# EAGLE design X8R_analog_sensor (EAGLE 6.4)
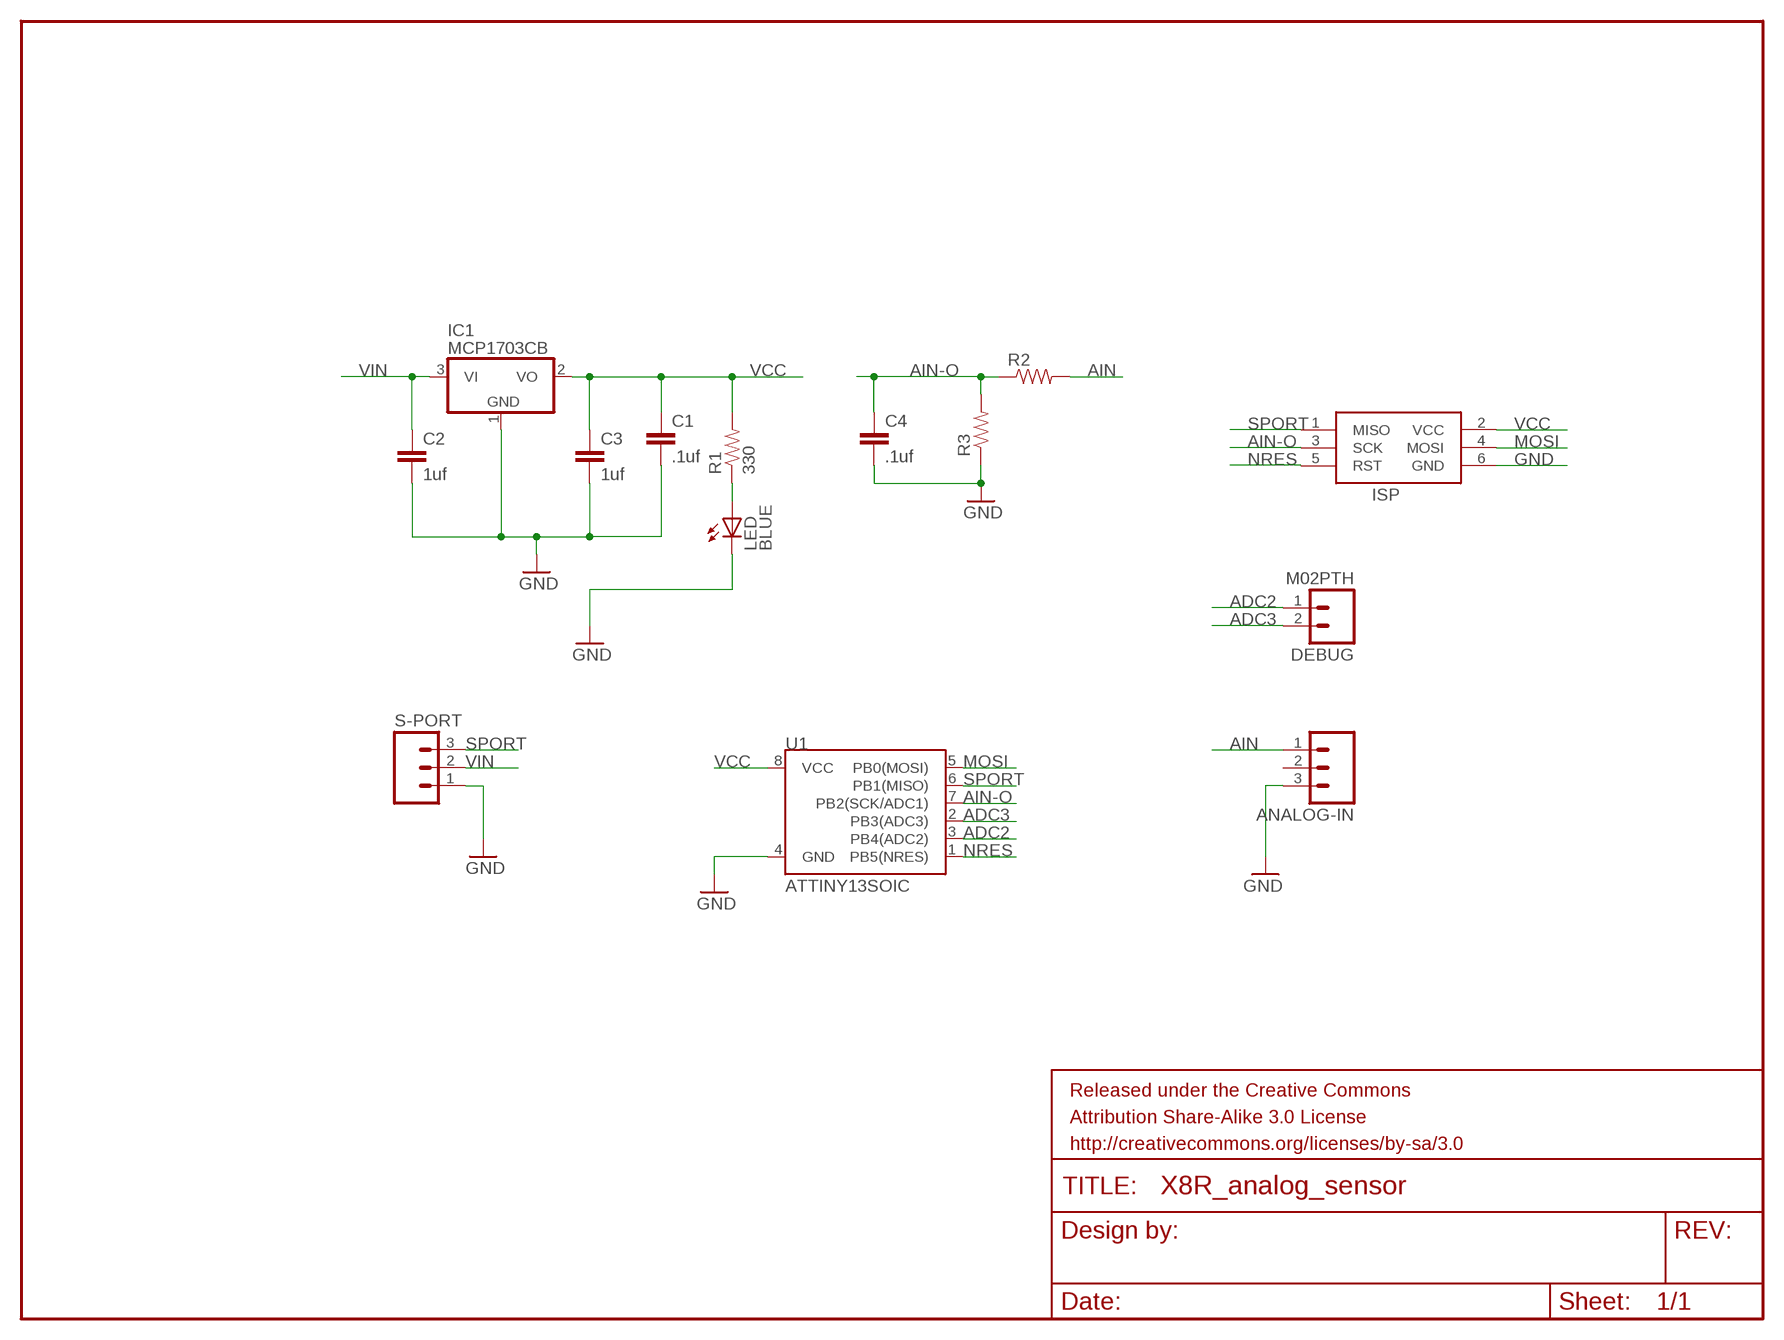
[diagram p0: schematic, sheet 1]

## Parts
ANALOG-IN  M03PTH  [1X03]
C1  .1uf  CAP0603-CAP  [0603-CAP]
C2  1uf  CAP0603-CAP  [0603-CAP]
C3  1uf  CAP0603-CAP  [0603-CAP]
C4  .1uf  CAP0603-CAP  [0603-CAP]
DEBUG  M02PTH  [1X02]
FRAME1  FRAME-LETTER  [CREATIVE_COMMONS]
IC1  MCP1703CB  [SOT23]
ISP  AVRISP-6  [AVRISP]
LED  BLUE  LED0603  [LED-0603]
R1  330  RESISTOR0603  [0603-RES]
R2  RESISTORPTH-1/6W  [1/6W-RES]
R3  RESISTORPTH-1/6W  [1/6W-RES]
S-PORT  M03PTH  [1X03]
U1  ATTINY13SOIC  [SO08]

## Nets
ADC2: DEBUG.1 U1.3(PB4(ADC2))
ADC3: DEBUG.2 U1.2(PB3(ADC3))
AIN: ANALOG-IN.1 R2.2
AIN-O: C4.1 ISP.3(SCK) R2.1 R3.2 U1.7(PB2(SCK/ADC1))
GND: ANALOG-IN.3 C1.2 C2.2 C3.2 C4.2 IC1.1(GND) ISP.6(GND) LED.C R3.1 S-PORT.1 U1.4(GND)
MOSI: ISP.4(MOSI) U1.5(PB0(MOSI))
N$7: LED.A R1.1
NRES: ISP.5(RST) U1.1(PB5(NRES))
SPORT: ISP.1(MISO) S-PORT.3 U1.6(PB1(MISO))
VCC: C1.1 C3.1 IC1.2(VO) ISP.2(VCC) R1.2 U1.8(VCC)
VIN: C2.1 IC1.3(VI) S-PORT.2
Unconnected: ANALOG-IN.2

## Library data of the parts
ANALOG-IN S-PORT = SparkFun-Connectors:M03: Header 3 Standard 3-pin 0.1" header. Use with straight break away headers (SKU : PRT-00116), right angle break away headers (PRT-00553), swiss pins (PRT-00743), machine pins (PRT-00117), and female headers (PRT-00115). Molex polarized connector foot print use with SKU : PRT-08232 with associated crimp pins and housings.
C1-C4 = SparkFun-Capacitors:CAP: Capacitor Standard 0603 ceramic capacitor, and 0.1" leaded capacitor.
DEBUG = SparkFun-Connectors:M02: Standard 2-pin 0.1" header. Use with - straight break away headers ( PRT-00116) - right angle break away headers (PRT-00553) - swiss pins (PRT-00743) - machine pins (PRT-00117) - female headers (PRT-00115) Molex polarized connector foot print use with: PRT-08233 with associated crimp pins and housings. 2.54_SCREWTERM for use with PRT-10571. 3.5mm Screw Terminal footprints for PRT-08084 5mm Screw Terminal footprints for use with PRT-08433
FRAME1 = SparkFun-Aesthetics:FRAME-LETTER: Schematic Frame Standard 8.5x11 US Letter frame
IC1 = linear:MCP1703: 250 mA, 16V, Low Quiescent Current LDO Regulator Source: http://ww1.microchip.com/downloads/en/DeviceDoc/22049b.pdf
ISP = adafruit:AVRISP: AVR ISP HEADER Standard 6 pin header for AVR programming
LED = SparkFun-LED:LED: LEDs Standard schematic elements and footprints for 5mm, 3mm, 1206, and 0603 sized LEDs. 5mm - Spark Fun Electronics SKU : COM-00529 (and others)
R1 = SparkFun-Resistors:RESISTOR: Resistor Basic schematic elements and footprints for 0603, 1206, and PTH resistors.
R2 R3 = SparkFun-Passives:RESISTOR: Resistor Basic schematic elements and footprints for 0603, 1206, and PTH resistors.
U1 = SparkFun-DigitalIC:ATTINY13: Atmel 8-pin 1kB flash uC

## Board
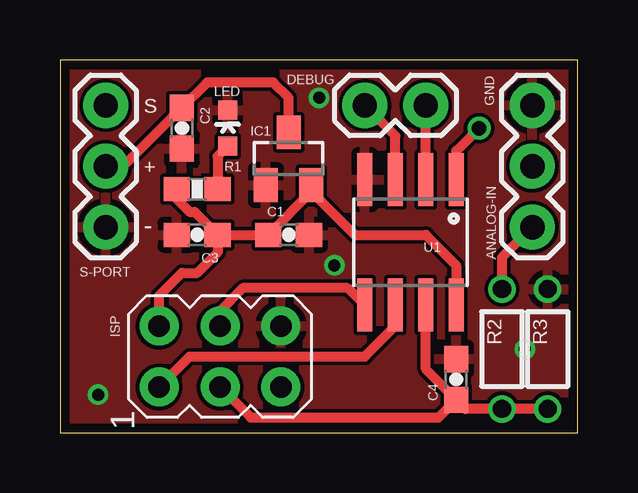
[diagram p1: board, top side]
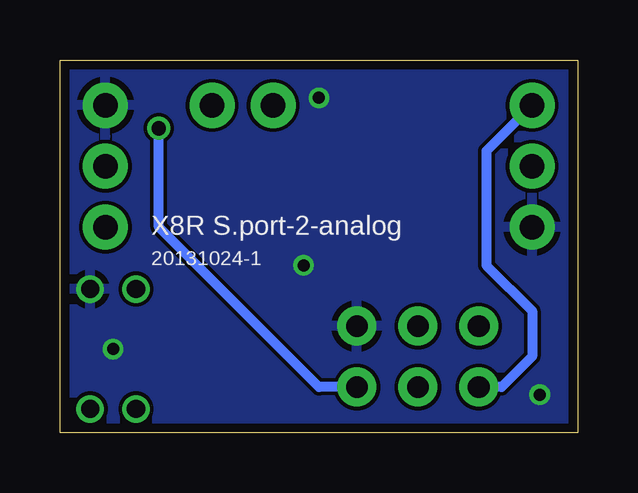
[diagram p2: board, bottom side, seen from below]

Size 21.58 x 15.55 mm. Coordinates in mm from the lower left corner, seen from the top.
Outline: 0,0 21.58,0 21.58,15.55 0,15.55 0,0
Copper layers (1*16): Top 0.0356mm / dielectric 1.5011mm / Bottom 0.0356mm
Design rules "LaenPCBOrder *": minimum track width 6mil, minimum drill 13mil, track to track 6mil, track to pad 6mil, pad to pad 6mil, via to via 6mil, smd to smd 6mil, copper to edge 15mil, drill to drill 6mil, minimum pad ring 7mil, minimum via ring 7mil, stop-mask expansion 3mil, vias tented up to drill 25mil, thermal gap 10mil

### Footprints (pad centres in the part's own frame; a part is rotated, then mirrored left to right if it is on the bottom)
1X03 = drill 1.016 pad 1.88: 1 0,0; 2 2.54,0; 3 5.08,0
0603-CAP = smd 1.1 x 1: 1 -0.85,0; 2 0.85,0
1X02 = drill 1.016 pad 1.88: 1 0,0; 2 2.54,0
SOT23 = smd 1 x 1.4: 1 -0.95,-1.1; 2 0.95,-1.1; 3 0,1.1
AVRISP = drill 0.9 pad 1.626: 1 -1.27,2.54; 2 1.27,2.54; 3 -1.27,0; 4 1.27,0; 5 -1.27,-2.54; 6 1.27,-2.54
LED-0603 = smd 0.8 x 0.8: A 0,-0.75; C 0,0.75
0603-RES = smd 1.1 x 1: 1 -0.85,0; 2 0.85,0
1/6W-RES = drill 0.762: 1 -2.5,0; 2 2.5,0
SO08 = smd 0.61 x 2.21: 1 -1.905,-2.616; 2 -0.635,-2.616; 3 0.635,-2.616; 4 1.905,-2.616; 5 1.905,2.616; 6 0.635,2.616; 7 -0.635,2.616; 8 -1.905,2.616

### Placement (x,y rotation side)
ANALOG-IN  19.68,8.57 90 top
C1  9.53,8.26 0 top
C2  5.08,12.7 270 top
C3  5.71,8.26 180 top
C4  16.51,2.22 90 top
DEBUG  12.7,13.65 0 top
FRAME1  -3.17,-11.43 0 top  (outside the outline)
IC1  9.53,11.43 0 top
ISP  6.67,3.17 90 top
LED  6.99,12.7 0 top
R1  5.71,10.16 180 top
R2  18.41,3.49 90 top
R3  20.32,3.49 270 top
S-PORT  1.91,8.57 90 top
U1  14.61,7.94 180 top

### Tracks (layer width: path | path; a pad name or v marks a point on that pad's centre or on a via)
ADC2
  Top 0.406: U1.3 13.97,12.38 DEBUG.1
ADC3
  Top 0.406: U1.2 DEBUG.2
AIN
  Top 0.406: ANALOG-IN.1 18.41,7.3 R2.2
AIN-O
  Top 0.406: ISP.3 7.94,0.64 15.77,0.64 C4.1 | R3.2 R2.1 16.89,0.99 C4.1 | C4.1 15.24,2.64 U1.7
GND  (via drill 0.5)
  other vias: 10.79,13.97 19.37,3.49 1.59,1.59 11.43,6.99
  pour Top: 0,15.56 21.59,15.56 21.59,0 0,0
  pour Bottom: 0,15.56 21.59,15.56 21.59,0 0,0
MOSI
  Top 0.406: U1.5 11.99,6.03 7.62,6.03 6.67,5.08 ISP.4
N$7
  Top 0.406: LED.A 6.57,11.53 R1.1
NRES  (via drill 0.6)
  Top 0.406: v17.46,12.7 16.51,11.75 U1.1
  Bottom 0.406: ISP.5 10.79,1.91 17.46,8.57 v17.46,12.7
SPORT
  Top 0.406: ISP.1 5.4,3.17 12.7,3.17 13.97,4.45 U1.6
  Bottom 0.406: S-PORT.3 3.81,11.75 3.81,6.99 1.91,5.08 1.91,3.17 3.17,1.91 ISP.1
VCC
  Top 0.406: IC1.2 10.47,10.05 | 10.47,10.05 C1.1 C3.1 | 10.47,10.05 12.28,8.26 15.24,8.26 16.51,6.99 U1.8 | R1.2 4.87,9.74 5.4,9.21 5.61,9.21 C3.1 | ISP.2 4.13,5.71 5.08,6.67 5.71,6.67 6.57,7.52 C3.1 | C3.1 6.35,8.26
VIN
  Top 0.406: S-PORT.2 2.64,11.11 C2.1 6.13,14.61 8.89,14.61 9.53,13.97 IC1.3

### Text on the board
tPlace: GND | S | + | -
bPlace: X8R S.port-2-analog | 20131024-1